# EAGLE design untitled (EAGLE 6.5.0)
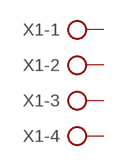
[diagram p0: schematic, sheet 1]

## Parts
X1  AK500/4-H  [AK500/4-H]
Unconnected: X1.1 X1.2 X1.3 X1.4

## Library data of the parts
X1 = con-ptr500:AK500/4-H: CONNECTOR Aug. 2004 / PTR Meßtechnik: Die Bezeichnung der Serie AK505 wurde geändert. Es handelt sich hierbei um AK500 in horizontaler Ausführung.; OC_FARNELL: unknown; OC_NEWARK: unknown

## Board
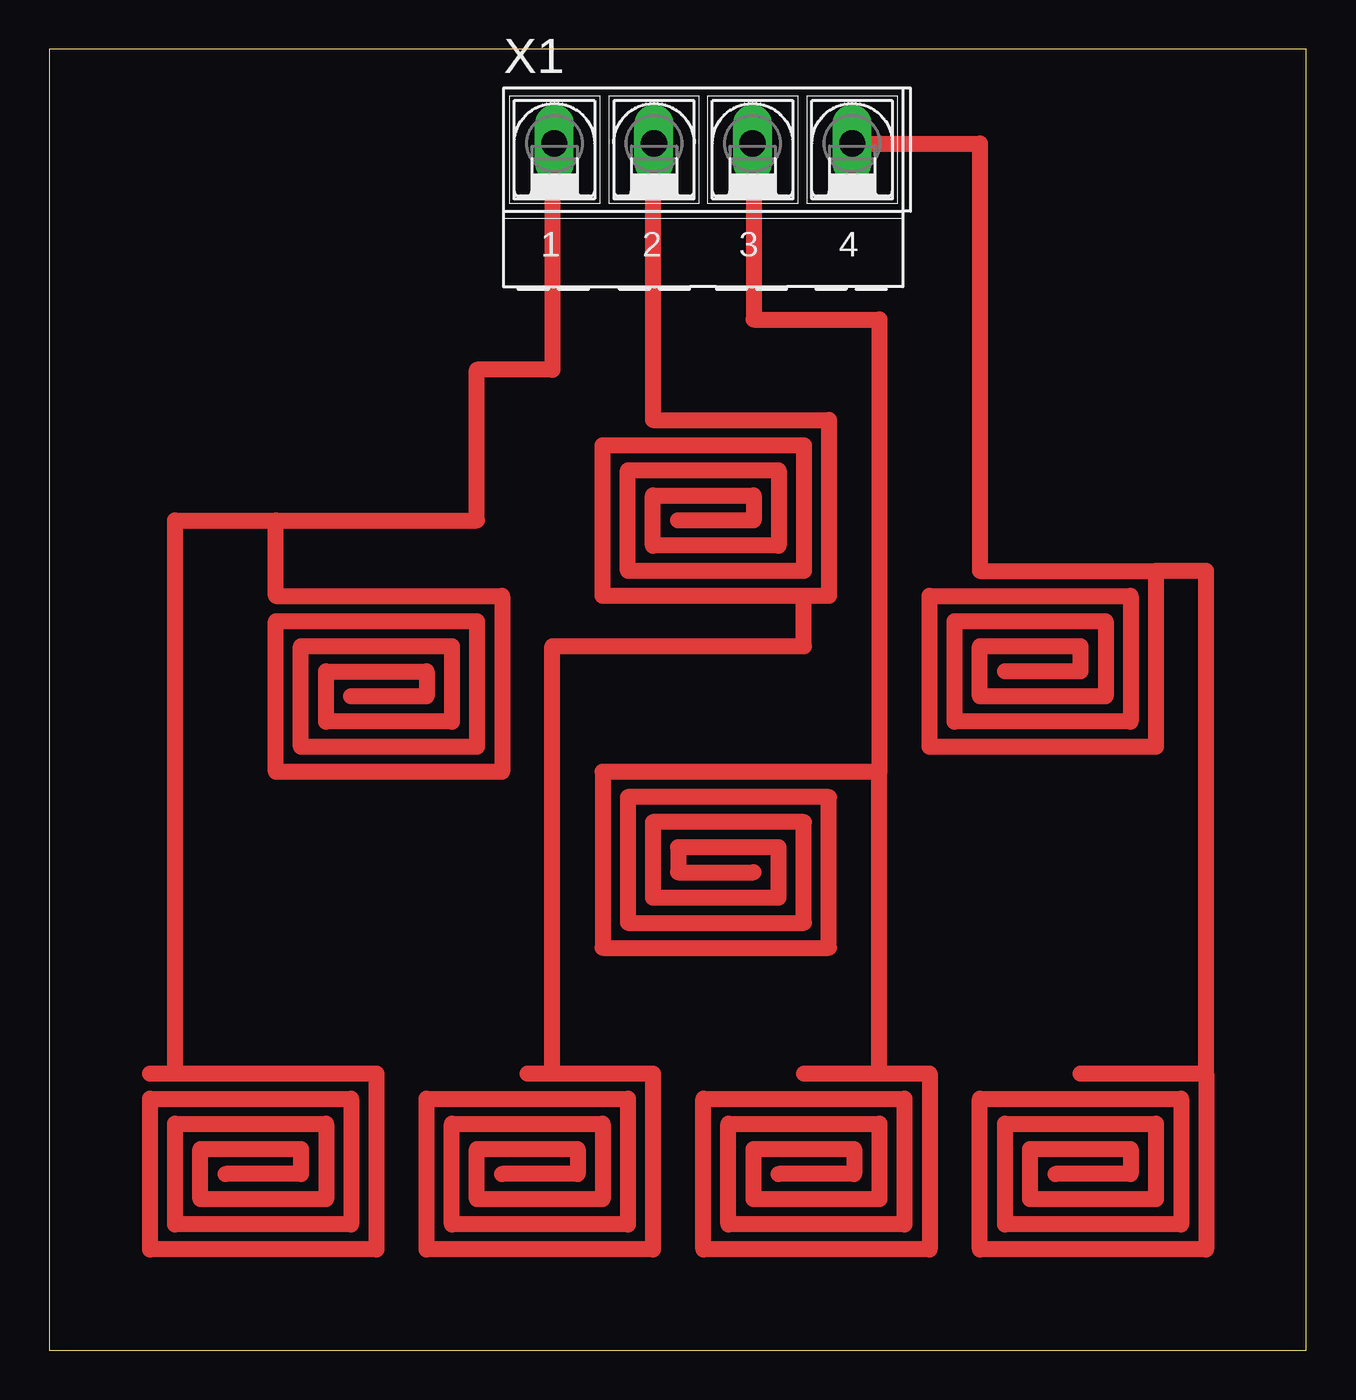
[diagram p1: board, top side]

Size 63.48 x 65.71 mm. Coordinates in mm from the lower left corner, seen from the top.
Outline: 0,0 63.48,0 63.48,65.71 0,65.71 0,0
Copper layers (1*16): Top 0.035mm / dielectric 1.5mm / Bottom 0.035mm
Design rules "default": minimum track width 10mil, minimum drill 24mil, track to track 8mil, track to pad 8mil, pad to pad 8mil, via to via 8mil, smd to smd 8mil, copper to edge 40mil, drill to drill 8mil, minimum pad ring 10mil, minimum via ring 8mil, stop-mask expansion 4mil, vias tented up to drill 0mil, thermal gap 10mil

### Footprints (pad centres in the part's own frame; a part is rotated, then mirrored left to right if it is on the bottom)
AK500/4-H = drill 1.321 long: 1 -7.518,0; 2 -2.489,0; 3 2.489,0; 4 7.518,0

### Placement (x,y rotation side)
X1  33.02,60.96 0 top

### Tracks (layer width: path | path; a pad name or v marks a point on that pad's centre or on a via)
N$5
  Top 0.813: 58.42,13.97 58.42,5.08 46.99,5.08 46.99,12.7 57.15,12.7 57.15,6.35 48.26,6.35 48.26,11.43 55.88,11.43 55.88,7.62 49.53,7.62 49.53,10.16 54.61,10.16 54.61,8.89 50.8,8.89 | 52.07,13.97 58.42,13.97 | 58.42,13.97 58.42,39.37 55.88,39.37 | 55.88,39.37 46.99,39.37 46.99,60.96 40.64,60.96 | 55.88,39.37 55.88,30.48 44.45,30.48 44.45,38.1 54.61,38.1 54.61,31.75 45.72,31.75 45.72,36.83 53.34,36.83 53.34,33.02 46.99,33.02 46.99,35.56 52.07,35.56 52.07,34.29 48.26,34.29
N$7
  Top 0.813: 25.4,13.97 30.48,13.97 30.48,5.08 19.05,5.08 19.05,12.7 29.21,12.7 29.21,6.35 20.32,6.35 20.32,11.43 27.94,11.43 27.94,7.62 21.59,7.62 21.59,10.16 26.67,10.16 26.67,8.89 22.86,8.89 | 24.13,13.97 25.4,13.97 | 25.4,13.97 25.4,35.56 38.1,35.56 38.1,38.1 | 30.48,60.96 30.48,46.99 39.37,46.99 39.37,38.1 38.1,38.1 | 38.1,38.1 27.94,38.1 27.94,45.72 38.1,45.72 38.1,39.37 29.21,39.37 29.21,44.45 36.83,44.45 36.83,40.64 30.48,40.64 30.48,43.18 35.56,43.18 35.56,41.91 31.75,41.91
N$8
  Top 0.813: 41.91,13.97 44.45,13.97 44.45,5.08 33.02,5.08 33.02,12.7 43.18,12.7 43.18,6.35 34.29,6.35 34.29,11.43 41.91,11.43 41.91,7.62 35.56,7.62 35.56,10.16 40.64,10.16 40.64,8.89 36.83,8.89 | 35.56,62.23 35.56,52.07 41.91,52.07 41.91,29.21 | 41.91,29.21 27.94,29.21 27.94,20.32 39.37,20.32 39.37,27.94 29.21,27.94 29.21,21.59 38.1,21.59 38.1,26.67 30.48,26.67 30.48,22.86 36.83,22.86 36.83,25.4 31.75,25.4 31.75,24.13 35.56,24.13 | 38.1,13.97 41.91,13.97 | 41.91,13.97 41.91,29.21
N$9
  Top 0.813: 8.89,8.89 12.7,8.89 12.7,10.16 7.62,10.16 7.62,7.62 13.97,7.62 13.97,11.43 6.35,11.43 6.35,6.35 15.24,6.35 15.24,12.7 5.08,12.7 5.08,5.08 16.51,5.08 16.51,13.97 6.35,13.97 | 5.08,13.97 6.35,13.97 | 6.35,13.97 6.35,41.91 11.43,41.91 | 15.24,33.02 19.05,33.02 19.05,34.29 13.97,34.29 13.97,31.75 20.32,31.75 20.32,35.56 12.7,35.56 12.7,30.48 21.59,30.48 21.59,36.83 11.43,36.83 11.43,29.21 22.86,29.21 22.86,38.1 11.43,38.1 11.43,41.91 | 25.4,60.96 25.4,49.53 21.59,49.53 21.59,41.91 11.43,41.91